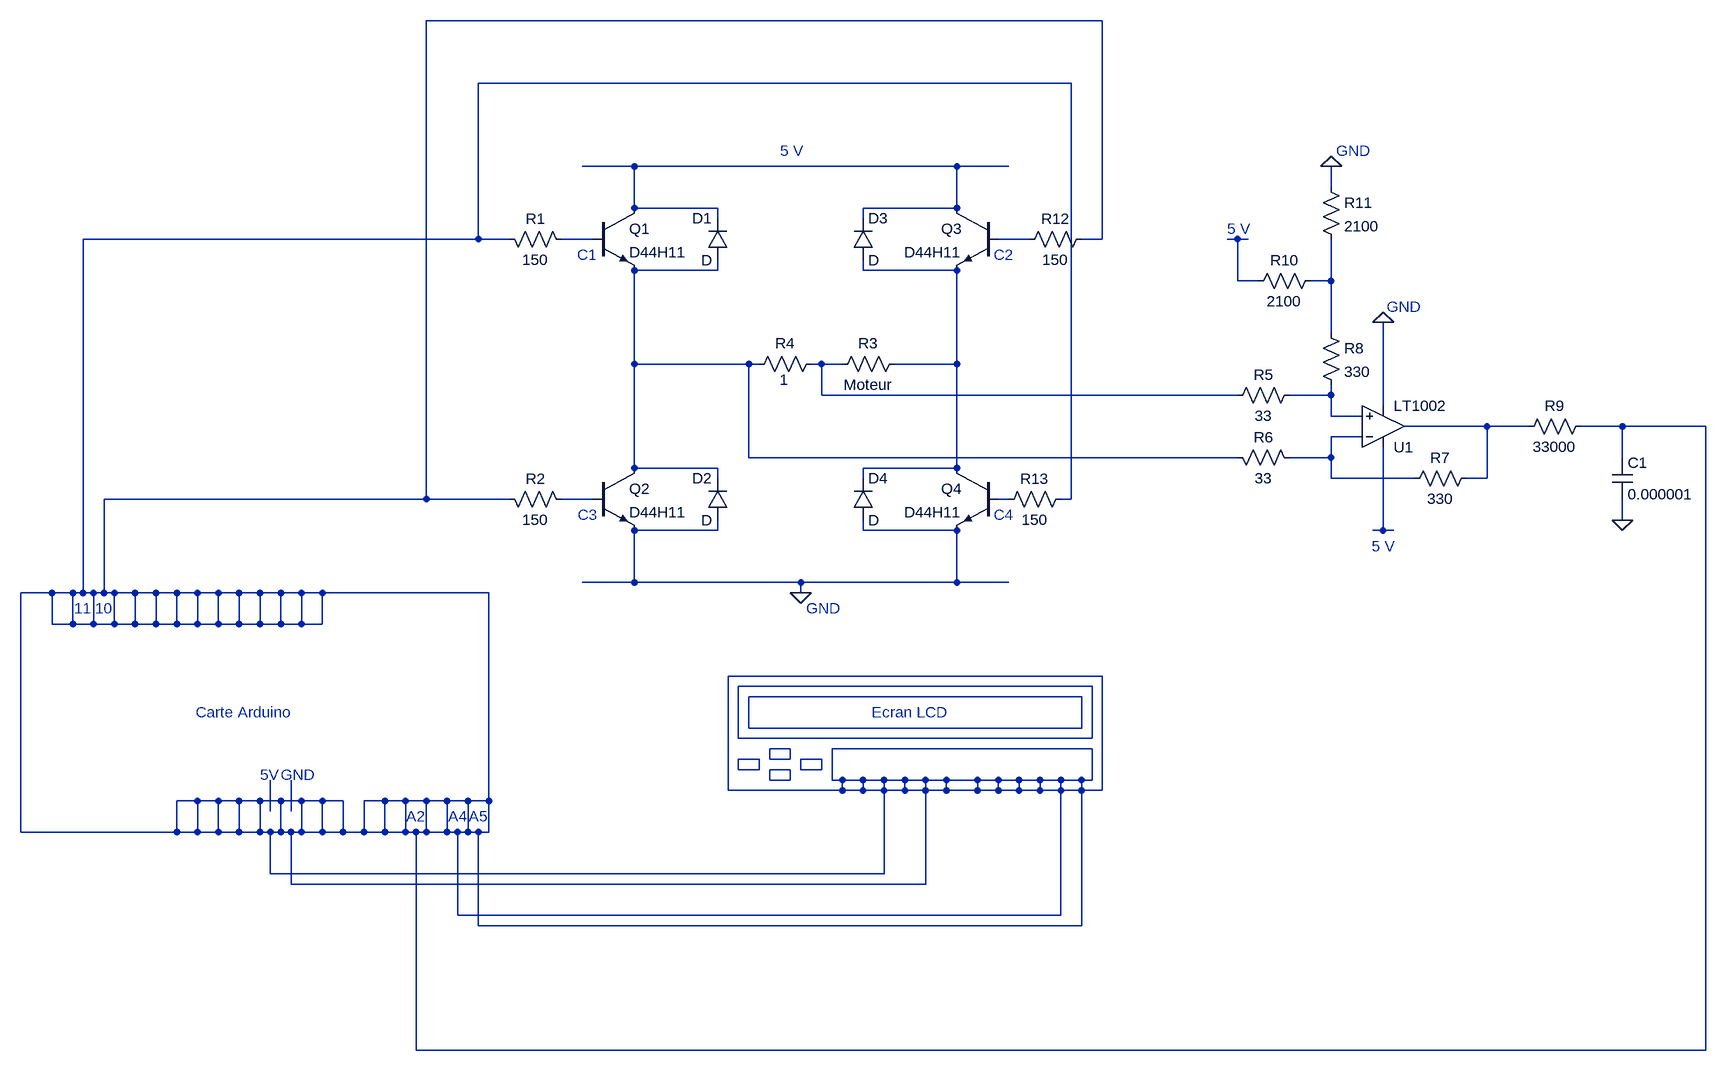
[diagram p0: schematic Draft1.asc]
Draft1.asc, the LTspice schematic file:
Version 4
SHEET 1 1844 1332
WIRE 912 -256 -128 -256
WIRE 864 -160 -48 -160
WIRE 192 -32 112 -32
WIRE 688 -32 192 -32
WIRE 768 -32 688 -32
WIRE 1264 0 1264 -32
WIRE 192 32 192 -32
WIRE 320 32 192 32
WIRE 688 32 688 -32
WIRE 688 32 544 32
WIRE 320 48 320 32
WIRE 544 48 544 32
WIRE -48 80 -48 -160
WIRE -48 80 -656 80
WIRE 0 80 -48 80
WIRE 128 80 80 80
WIRE 800 80 752 80
WIRE 912 80 912 -256
WIRE 912 80 880 80
WIRE 1120 80 1104 80
WIRE 1136 80 1120 80
WIRE 320 128 320 112
WIRE 320 128 192 128
WIRE 544 128 544 112
WIRE 688 128 544 128
WIRE 1120 144 1120 80
WIRE 1152 144 1120 144
WIRE 1264 144 1264 80
WIRE 1264 144 1232 144
WIRE 1264 224 1264 144
WIRE 192 272 192 128
WIRE 368 272 192 272
WIRE 384 272 368 272
WIRE 480 272 464 272
WIRE 512 272 480 272
WIRE 688 272 688 128
WIRE 688 272 592 272
WIRE 480 320 480 272
WIRE 1120 320 480 320
WIRE 1264 320 1264 304
WIRE 1264 320 1200 320
WIRE 1344 336 1344 208
WIRE 1264 352 1264 320
WIRE 1312 352 1264 352
WIRE 1504 368 1376 368
WIRE 1568 368 1504 368
WIRE 1712 368 1648 368
WIRE 1840 368 1712 368
WIRE 1312 384 1264 384
WIRE 368 416 368 272
WIRE 1120 416 368 416
WIRE 1264 416 1264 384
WIRE 1264 416 1200 416
WIRE 1712 416 1712 368
WIRE 192 432 192 272
WIRE 320 432 192 432
WIRE 688 432 688 272
WIRE 688 432 544 432
WIRE 320 448 320 432
WIRE 544 448 544 432
WIRE 1264 448 1264 416
WIRE 1392 448 1264 448
WIRE 1504 448 1504 368
WIRE 1504 448 1472 448
WIRE -128 480 -128 -256
WIRE -128 480 -624 480
WIRE 0 480 -128 480
WIRE 128 480 80 480
WIRE 768 480 752 480
WIRE 864 480 864 -160
WIRE 864 480 848 480
WIRE 1712 512 1712 480
WIRE 320 528 320 512
WIRE 320 528 192 528
WIRE 544 528 544 512
WIRE 688 528 544 528
WIRE 1344 528 1344 400
WIRE 1344 528 1328 528
WIRE 1360 528 1344 528
WIRE 192 608 192 528
WIRE 192 608 112 608
WIRE 448 608 192 608
WIRE 688 608 688 528
WIRE 688 608 448 608
WIRE 768 608 688 608
WIRE -704 624 -752 624
WIRE -672 624 -704 624
WIRE -656 624 -656 80
WIRE -656 624 -672 624
WIRE -640 624 -656 624
WIRE -624 624 -624 480
WIRE -624 624 -640 624
WIRE -608 624 -624 624
WIRE -576 624 -608 624
WIRE -544 624 -576 624
WIRE -512 624 -544 624
WIRE -480 624 -512 624
WIRE -448 624 -480 624
WIRE -416 624 -448 624
WIRE -384 624 -416 624
WIRE -352 624 -384 624
WIRE -320 624 -352 624
WIRE -288 624 -320 624
WIRE -32 624 -288 624
WIRE 448 624 448 608
WIRE -704 672 -704 624
WIRE -672 672 -672 624
WIRE -672 672 -704 672
WIRE -640 672 -640 624
WIRE -640 672 -672 672
WIRE -608 672 -608 624
WIRE -608 672 -640 672
WIRE -576 672 -576 624
WIRE -576 672 -608 672
WIRE -544 672 -544 624
WIRE -544 672 -576 672
WIRE -512 672 -512 624
WIRE -512 672 -544 672
WIRE -480 672 -480 624
WIRE -480 672 -512 672
WIRE -448 672 -448 624
WIRE -448 672 -480 672
WIRE -416 672 -416 624
WIRE -416 672 -448 672
WIRE -384 672 -384 624
WIRE -384 672 -416 672
WIRE -352 672 -352 624
WIRE -352 672 -384 672
WIRE -320 672 -320 624
WIRE -320 672 -352 672
WIRE -288 672 -288 624
WIRE -288 672 -320 672
WIRE 912 752 336 752
WIRE 896 768 352 768
WIRE 880 784 368 784
WIRE 368 832 368 784
WIRE 880 832 880 784
WIRE 880 832 368 832
WIRE 352 848 352 768
WIRE 896 848 896 768
WIRE 896 848 352 848
WIRE 432 864 400 864
WIRE 896 864 496 864
WIRE 384 880 352 880
WIRE 400 880 400 864
WIRE 432 880 432 864
WIRE 432 880 400 880
WIRE 480 880 448 880
WIRE 352 896 352 880
WIRE 384 896 384 880
WIRE 384 896 352 896
WIRE 432 896 400 896
WIRE 448 896 448 880
WIRE 480 896 480 880
WIRE 480 896 448 896
WIRE 400 912 400 896
WIRE 432 912 432 896
WIRE 432 912 400 912
WIRE 496 912 496 864
WIRE 512 912 496 912
WIRE 544 912 512 912
WIRE 576 912 544 912
WIRE 608 912 576 912
WIRE 640 912 608 912
WIRE 672 912 640 912
WIRE 720 912 672 912
WIRE 752 912 720 912
WIRE 784 912 752 912
WIRE 816 912 784 912
WIRE 848 912 816 912
WIRE 880 912 848 912
WIRE 896 912 896 864
WIRE 896 912 880 912
WIRE 336 928 336 752
WIRE 512 928 512 912
WIRE 512 928 336 928
WIRE 544 928 544 912
WIRE 544 928 512 928
WIRE 576 928 576 912
WIRE 576 928 544 928
WIRE 608 928 608 912
WIRE 608 928 576 928
WIRE 640 928 640 912
WIRE 640 928 608 928
WIRE 672 928 672 912
WIRE 672 928 640 928
WIRE 720 928 720 912
WIRE 720 928 672 928
WIRE 752 928 752 912
WIRE 752 928 720 928
WIRE 784 928 784 912
WIRE 784 928 752 928
WIRE 816 928 816 912
WIRE 816 928 784 928
WIRE 848 928 848 912
WIRE 848 928 816 928
WIRE 880 928 880 912
WIRE 880 928 848 928
WIRE 912 928 912 752
WIRE 912 928 880 928
WIRE -480 944 -512 944
WIRE -448 944 -480 944
WIRE -416 944 -448 944
WIRE -384 944 -416 944
WIRE -352 944 -384 944
WIRE -320 944 -352 944
WIRE -288 944 -320 944
WIRE -256 944 -288 944
WIRE -192 944 -224 944
WIRE -160 944 -192 944
WIRE -128 944 -160 944
WIRE -96 944 -128 944
WIRE -64 944 -96 944
WIRE -32 944 -32 624
WIRE -32 944 -64 944
WIRE -368 960 -368 912
WIRE -336 960 -336 912
WIRE -752 992 -752 624
WIRE -512 992 -512 944
WIRE -512 992 -752 992
WIRE -480 992 -480 944
WIRE -480 992 -512 992
WIRE -448 992 -448 944
WIRE -448 992 -480 992
WIRE -416 992 -416 944
WIRE -416 992 -448 992
WIRE -384 992 -384 944
WIRE -384 992 -416 992
WIRE -368 992 -384 992
WIRE -352 992 -352 944
WIRE -352 992 -368 992
WIRE -336 992 -352 992
WIRE -320 992 -320 944
WIRE -320 992 -336 992
WIRE -288 992 -288 944
WIRE -288 992 -320 992
WIRE -256 992 -256 944
WIRE -256 992 -288 992
WIRE -224 992 -224 944
WIRE -224 992 -256 992
WIRE -192 992 -192 944
WIRE -192 992 -224 992
WIRE -160 992 -160 944
WIRE -160 992 -192 992
WIRE -144 992 -160 992
WIRE -128 992 -128 944
WIRE -128 992 -144 992
WIRE -96 992 -96 944
WIRE -96 992 -128 992
WIRE -80 992 -96 992
WIRE -64 992 -64 944
WIRE -64 992 -80 992
WIRE -48 992 -64 992
WIRE -32 992 -32 944
WIRE -32 992 -48 992
WIRE -368 1056 -368 992
WIRE 576 1056 576 928
WIRE 576 1056 -368 1056
WIRE -336 1072 -336 992
WIRE 640 1072 640 928
WIRE 640 1072 -336 1072
WIRE -80 1120 -80 992
WIRE 848 1120 848 928
WIRE 848 1120 -80 1120
WIRE -48 1136 -48 992
WIRE 880 1136 880 928
WIRE 880 1136 -48 1136
WIRE -144 1328 -144 992
WIRE 1840 1328 1840 368
WIRE 1840 1328 -144 1328
FLAG 448 624 0
FLAG 1264 -32 0
FLAG 1344 208 0
FLAG 1712 512 0
SYMBOL res 96 96 M270
WINDOW 0 32 56 VTop 2
WINDOW 3 0 56 VBottom 2
SYMATTR InstName R1
SYMATTR Value 150
SYMATTR SpiceLine tol=5
SYMBOL res 96 496 M270
WINDOW 0 32 56 VTop 2
WINDOW 3 0 56 VBottom 2
SYMATTR InstName R2
SYMATTR Value 150
SYMATTR SpiceLine tol=5
SYMBOL diode 336 112 R180
WINDOW 0 24 64 Left 2
WINDOW 3 24 0 Left 2
SYMATTR InstName D1
SYMBOL diode 336 512 R180
WINDOW 0 24 64 Left 2
WINDOW 3 24 0 Left 2
SYMATTR InstName D2
SYMBOL npn 128 32 R0
SYMATTR InstName Q1
SYMATTR Value D44H11
SYMBOL npn 128 432 R0
SYMATTR InstName Q2
SYMATTR Value D44H11
SYMBOL npn 752 32 M0
SYMATTR InstName Q3
SYMATTR Value D44H11
SYMBOL npn 752 432 M0
SYMATTR InstName Q4
SYMATTR Value D44H11
SYMBOL diode 528 112 M180
WINDOW 0 24 64 Left 2
WINDOW 3 24 0 Left 2
SYMATTR InstName D3
SYMBOL diode 528 512 M180
WINDOW 0 24 64 Left 2
WINDOW 3 24 0 Left 2
SYMATTR InstName D4
SYMBOL res 608 256 R90
WINDOW 0 0 56 VBottom 2
WINDOW 3 32 56 VTop 2
SYMATTR InstName R3
SYMATTR Value Moteur
SYMBOL res 480 256 R90
WINDOW 0 0 56 VBottom 2
WINDOW 3 56 58 VBottom 2
SYMATTR InstName R4
SYMATTR Value 1
SYMATTR SpiceLine tol=5 pwr=5%
SYMBOL res 1216 304 R90
WINDOW 0 0 56 VBottom 2
WINDOW 3 32 56 VTop 2
SYMATTR InstName R5
SYMATTR Value 33
SYMATTR SpiceLine tol=5
SYMBOL res 1104 400 M90
WINDOW 0 0 56 VBottom 2
WINDOW 3 32 56 VTop 2
SYMATTR InstName R6
SYMATTR Value 33
SYMATTR SpiceLine tol=5
SYMBOL Opamps\\LT1002 1344 432 M180
SYMATTR InstName U1
SYMBOL res 1488 432 R90
WINDOW 0 0 56 VBottom 2
WINDOW 3 32 56 VTop 2
SYMATTR InstName R7
SYMATTR Value 330
SYMBOL res 1248 208 R0
SYMATTR InstName R8
SYMATTR Value 330
SYMBOL res 1664 352 R90
WINDOW 0 0 56 VBottom 2
WINDOW 3 32 56 VTop 2
SYMATTR InstName R9
SYMATTR Value 33000
SYMBOL cap 1696 416 R0
SYMATTR InstName C1
SYMATTR Value 0.000001
SYMBOL res 1248 128 R90
WINDOW 0 0 56 VBottom 2
WINDOW 3 32 56 VTop 2
SYMATTR InstName R10
SYMATTR Value 2100
SYMATTR SpiceLine tol=5
SYMBOL res 1248 -16 R0
SYMATTR InstName R11
SYMATTR Value 2100
SYMATTR SpiceLine tol=5
SYMBOL res 896 64 R90
WINDOW 0 0 56 VBottom 2
WINDOW 3 32 56 VTop 2
SYMATTR InstName R12
SYMATTR Value 150
SYMATTR SpiceLine tol=5
SYMBOL res 864 464 R90
WINDOW 0 0 56 VBottom 2
WINDOW 3 32 56 VTop 2
SYMATTR InstName R13
SYMATTR Value 150
SYMATTR SpiceLine tol=5
TEXT 416 -56 Left 2 ;5 V
TEXT 456 648 Left 2 ;GND
TEXT -656 648 Center 2 ;11
TEXT -624 648 Center 2 ;10
TEXT 1272 -56 Left 2 ;GND
TEXT -408 808 Center 2 ;Carte Arduino
TEXT 1344 552 Center 2 ;5 V
TEXT -144 968 Center 2 ;A2
TEXT 1376 184 Center 2 ;GND
TEXT -80 968 Center 2 ;A4
TEXT -48 968 Center 2 ;A5
TEXT 616 808 Center 2 ;Ecran LCD
TEXT 104 104 Left 2 ;C1
TEXT 760 104 Center 2 ;C2
TEXT 120 504 Center 2 ;C3
TEXT 760 504 Center 2 ;C4
TEXT -384 904 Left 2 ;5V
TEXT -352 904 Left 2 ;GND
TEXT 1104 64 Left 2 ;5 V

The netlist it stands for:
* Draft1.asc
R1 N003 N001 150 tol=5
R2 N013 N001 150 tol=5
D1 N006 N002 D
D2 0 N006 D
Q1 N002 N003 N006 0 D44H11
Q2 N006 N013 0 0 D44H11
Q3 N002 N004 N007 0 D44H11
Q4 N007 N014 0 0 D44H11
D3 N007 N002 D
D4 0 N007 D
R3 N007 N009 Moteur
R4 N009 N006 1 tol=5 pwr=5%
R5 N010 N009 33 tol=5
R6 N006 N012 33 tol=5
XU1 N010 N012 N015 0 N011 LT1002  ; pins In+ In- V+ V- OUT
R7 N011 N012 330
R8 N008 N010 330
R9 N001 N011 33000
C1 N001 0 0.000001
R10 N008 N005 2100 tol=5
R11 0 N008 2100 tol=5
R12 N001 N004 150 tol=5
R13 N001 N014 150 tol=5
.model D D
.lib standard.dio
.model NPN NPN
.model PNP PNP
.lib standard.bjt
* 5 V
* GND
* 11
* 10
* GND
* Carte Arduino
* 5 V
* A2
* GND
* A4
* A5
* Ecran LCD
* C1
* C2
* C3
* C4
* 5V
* GND
* 5 V
.backanno
.end